# Altium project ADC_schematic.PrjPcb
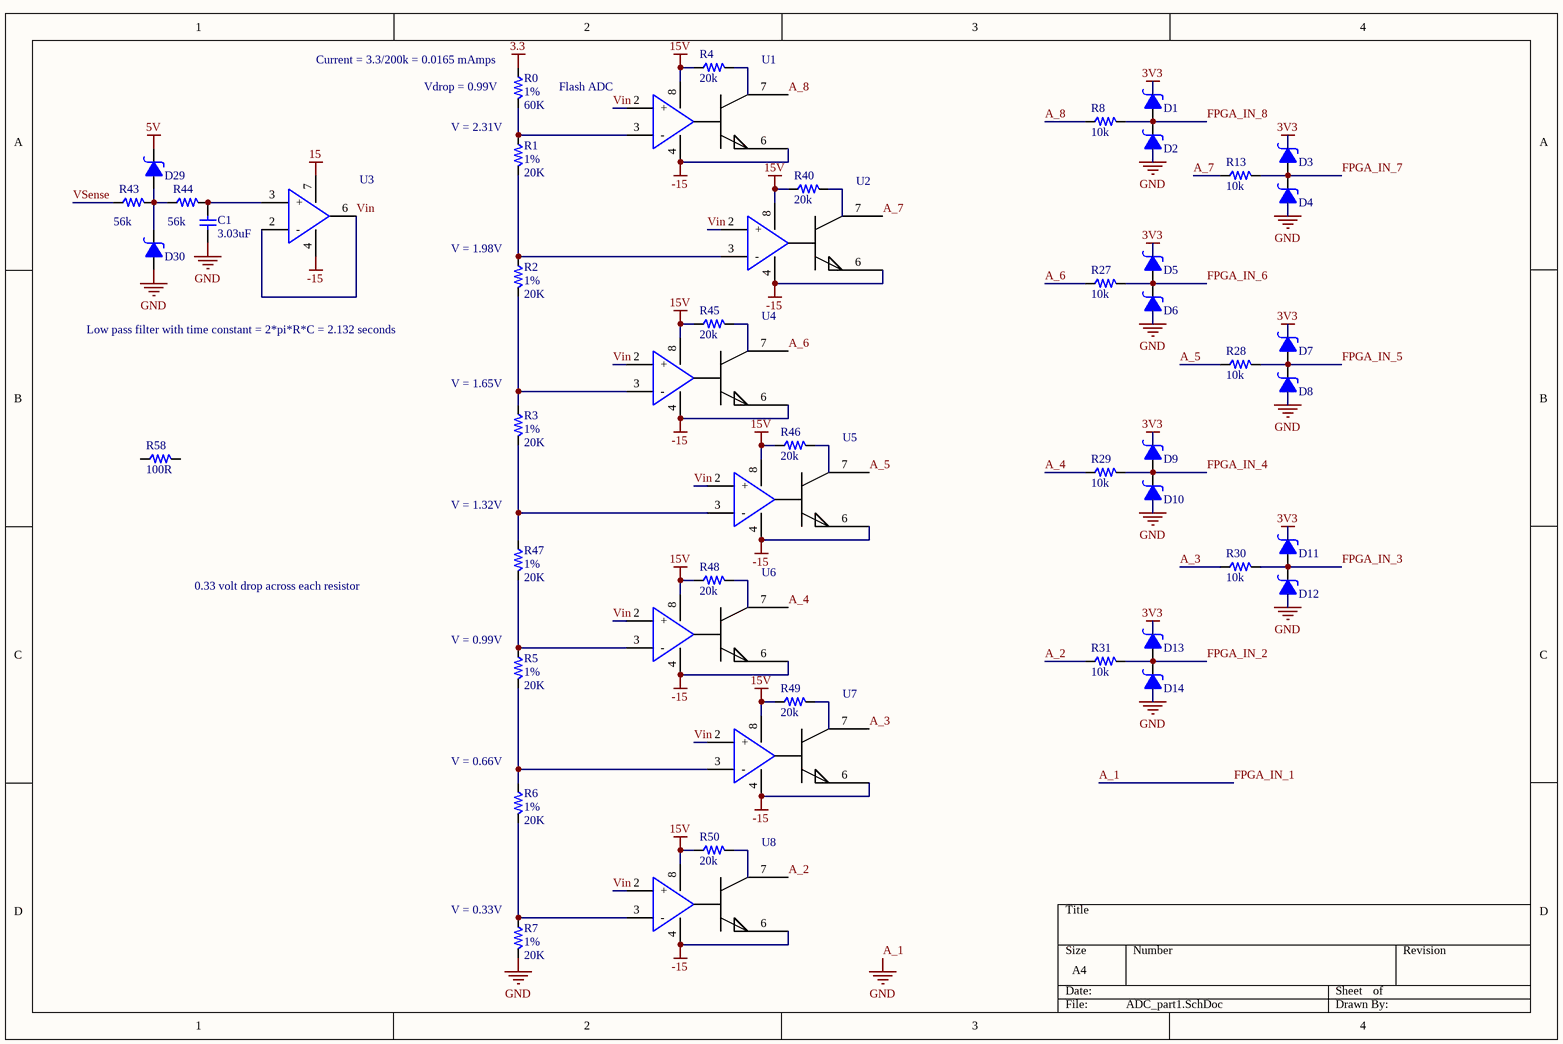
[diagram p0: ADC_part1.SchDoc]
3 sheets, 110 parts. Net scope: global (net labels, ports and power ports of the same name join across sheets).
Sheets:
  ADC_part1.SchDoc
  ADC_part2.SchDoc
  ADC_part3.SchDoc

## Sheet ADC_part1.SchDoc
size A4

### Parts
C1  value 3.03uF  [PCB_GENERIC_SMD_0603]  (hidden comment: C060-0001U-00)
D1  ONSEMI_MBRM110LT1G  [ON Semi Schottky Diode - MBRM110LT1G]  (value not drawn)
D2  ONSEMI_MBRM110LT1G  [ON Semi Schottky Diode - MBRM110LT1G]  (value not drawn)
D3  ONSEMI_MBRM110LT1G  [ON Semi Schottky Diode - MBRM110LT1G]  (value not drawn)
D4  ONSEMI_MBRM110LT1G  [ON Semi Schottky Diode - MBRM110LT1G]  (value not drawn)
D5  ONSEMI_MBRM110LT1G  [ON Semi Schottky Diode - MBRM110LT1G]  (value not drawn)
D6  ONSEMI_MBRM110LT1G  [ON Semi Schottky Diode - MBRM110LT1G]  (value not drawn)
D7  ONSEMI_MBRM110LT1G  [ON Semi Schottky Diode - MBRM110LT1G]  (value not drawn)
D8  ONSEMI_MBRM110LT1G  [ON Semi Schottky Diode - MBRM110LT1G]  (value not drawn)
D9  ONSEMI_MBRM110LT1G  [ON Semi Schottky Diode - MBRM110LT1G]  (value not drawn)
D10  ONSEMI_MBRM110LT1G  [ON Semi Schottky Diode - MBRM110LT1G]  (value not drawn)
D11  ONSEMI_MBRM110LT1G  [ON Semi Schottky Diode - MBRM110LT1G]  (value not drawn)
D12  ONSEMI_MBRM110LT1G  [ON Semi Schottky Diode - MBRM110LT1G]  (value not drawn)
D13  ONSEMI_MBRM110LT1G  [ON Semi Schottky Diode - MBRM110LT1G]  (value not drawn)
D14  ONSEMI_MBRM110LT1G  [ON Semi Schottky Diode - MBRM110LT1G]  (value not drawn)
D29  ONSEMI_MBRM110LT1G  [ON Semi Schottky Diode - MBRM110LT1G]  (value not drawn)
D30  ONSEMI_MBRM110LT1G  [ON Semi Schottky Diode - MBRM110LT1G]  (value not drawn)
R0  value 60K  Tolerance: 1%  [PCB_GENERIC_SMD_0603]  (hidden comment: R060-00103-01)
R1  value 20K  Tolerance: 1%  [PCB_GENERIC_SMD_0603]  (hidden comment: R060-00103-01)
R2  value 20K  Tolerance: 1%  [PCB_GENERIC_SMD_0603]  (hidden comment: R060-00103-01)
R3  value 20K  Tolerance: 1%  [PCB_GENERIC_SMD_0603]  (hidden comment: R060-00103-01)
R4  value 20k  [PCB_GENERIC_SMD_0603]  (hidden comment: R060-00101-05)
R5  value 20K  Tolerance: 1%  [PCB_GENERIC_SMD_0603]  (hidden comment: R060-00103-01)
R6  value 20K  Tolerance: 1%  [PCB_GENERIC_SMD_0603]  (hidden comment: R060-00103-01)
R7  value 20K  Tolerance: 1%  [PCB_GENERIC_SMD_0603]  (hidden comment: R060-00103-01)
R8  value 10k  [PCB_GENERIC_SMD_0603]  (hidden comment: R060-00101-05)
R13  value 10k  [PCB_GENERIC_SMD_0603]  (hidden comment: R060-00101-05)
R27  value 10k  [PCB_GENERIC_SMD_0603]  (hidden comment: R060-00101-05)
R28  value 10k  [PCB_GENERIC_SMD_0603]  (hidden comment: R060-00101-05)
R29  value 10k  [PCB_GENERIC_SMD_0603]  (hidden comment: R060-00101-05)
R30  value 10k  [PCB_GENERIC_SMD_0603]  (hidden comment: R060-00101-05)
R31  value 10k  [PCB_GENERIC_SMD_0603]  (hidden comment: R060-00101-05)
R40  value 20k  [PCB_GENERIC_SMD_0603]  (hidden comment: R060-00101-05)
R43  value 56k  [PCB_GENERIC_SMD_0603]  (hidden comment: R060-00101-05)
R44  value 56k  [PCB_GENERIC_SMD_0603]  (hidden comment: R060-00101-05)
R45  value 20k  [PCB_GENERIC_SMD_0603]  (hidden comment: R060-00101-05)
R46  value 20k  [PCB_GENERIC_SMD_0603]  (hidden comment: R060-00101-05)
R47  value 20K  Tolerance: 1%  [PCB_GENERIC_SMD_0603]  (hidden comment: R060-00103-01)
R48  value 20k  [PCB_GENERIC_SMD_0603]  (hidden comment: R060-00101-05)
R49  value 20k  [PCB_GENERIC_SMD_0603]  (hidden comment: R060-00101-05)
R50  value 20k  [PCB_GENERIC_SMD_0603]  (hidden comment: R060-00101-05)
R58  value 100R  [PCB_GENERIC_SMD_0603]  (hidden comment: R060-00101-05)
U1  AP331A  [SOT95P285X130-5N]  (value not drawn)
U2  AP331A  [SOT95P285X130-5N]  (value not drawn)
U3  AP331A  [SOT95P285X130-5N]  (value not drawn)
U4  AP331A  [SOT95P285X130-5N]  (value not drawn)
U5  AP331A  [SOT95P285X130-5N]  (value not drawn)
U6  AP331A  [SOT95P285X130-5N]  (value not drawn)
U7  AP331A  [SOT95P285X130-5N]  (value not drawn)
U8  AP331A  [SOT95P285X130-5N]  (value not drawn)

### Nets
3.3: R0.1
3V3: D1.1 D3.1 D5.1 D7.1 D9.1 D11.1 D13.1
5V: D29.1
15: U3.7(VCC)
15V: R4.1 R40.1 R45.1 R46.1 R48.1 R49.1 R50.1 U1.8(VCC) U2.8(VCC) U4.8(VCC) U5.8(VCC) U6.8(VCC) U7.8(VCC) U8.8(VCC)
-15: U1.4(GND) U1.6 U2.4(GND) U2.6 U3.4(GND) U4.4(GND) U4.6 U5.4(GND) U5.6 U6.4(GND) U6.6 U7.4(GND) U7.6 U8.4(GND) U8.6
A_1: C1.1 D2.2 D4.2 D6.2 D8.2 D10.2 D12.2 D14.2 D30.2 R7.2  [also labelled FPGA_IN_1, GND]
A_2: R31.1 U8.7
A_3: R30.1 U7.7
A_4: R29.1 U6.7
A_5: R28.1 U5.7
A_6: R27.1 U4.7
A_7: R13.1 U2.7
A_8: R8.1 U1.7
FPGA_IN_2: D13.2 D14.1 R31.2
FPGA_IN_3: D11.2 D12.1 R30.2
FPGA_IN_4: D9.2 D10.1 R29.2
FPGA_IN_5: D7.2 D8.1 R28.2
FPGA_IN_6: D5.2 D6.1 R27.2
FPGA_IN_7: D3.2 D4.1 R13.2
FPGA_IN_8: D1.2 D2.1 R8.2
Vin: U1.2(+) U2.2(+) U3.2(-) U3.6 U4.2(+) U5.2(+) U6.2(+) U7.2(+) U8.2(+)
VSense: R43.1
NetC1_2: C1.2 R44.2 U3.3(+)
NetD29_2: D29.2 D30.1 R43.2 R44.1
NetR0_2: R0.2 R1.1 U1.3(-)
NetR1_2: R1.2 R2.1 U2.3(-)
NetR2_2: R2.2 R3.1 U4.3(-)
NetR3_2: R3.2 R47.1 U5.3(-)
NetR5_1: R5.1 R47.2 U6.3(-)
NetR5_2: R5.2 R6.1 U7.3(-)
NetR6_2: R6.2 R7.1 U8.3(-)

Not connected (* = marked no-connect by the designer): R4 2; R40 2; R45 2; R46 2; R48 2; R49 2; R50 2; R58 1 2

### Notes on the sheet
- (near R0) Current = 3.3/200k = 0.0165 mAmps
- (near R0) Vdrop = 0.99V
- Flash ADC
- V = 2.31V
- (near R2) V = 1.98V
- Low pass filter with time constant = 2*pi*R*C = 2.132 seconds
- (near R3) V = 1.65V
- (near R47) V = 1.32V
- 0.33 volt drop across each resistor
- (near R5) V = 0.99V
- (near R6) V = 0.66V
- (near R7) V = 0.33V

### Library data of the parts
C1 = C060-0001U-00: CAP CER 0603 1uF 16V X5R 20%; Tolerance: 20%; Voltage: 16V; Package: 0603
D1-D14 D29 D30 = ONSEMI_MBRM110LT1G: DIODE SCHOTTKY 10V 1A; Supplier 1: Digi-Key; Supplier Part Number 1: MBRM110LT1GOSDKR-ND
R0-R3 R5-R7 R47 = R060-00103-01: RES 0603 10K 1% 100mW; Power: 100mW; Package: 0603
R4 R8 R13 R27-R31 R40 R43-R46 R48-R50 R58 = R060-00101-05: RES 0603 100ohm 5% 63mW; Tolerance: 5%; Power: 63mW; Package: 0603
U1-U8 = AP331A: Single Channel Comparator, Open Drain, SC-74A/SOT-753; Supplier 1: Digikey; Supplier Part Number 1: AP331AWGDICT-ND

## Sheet ADC_part2.SchDoc
size A4
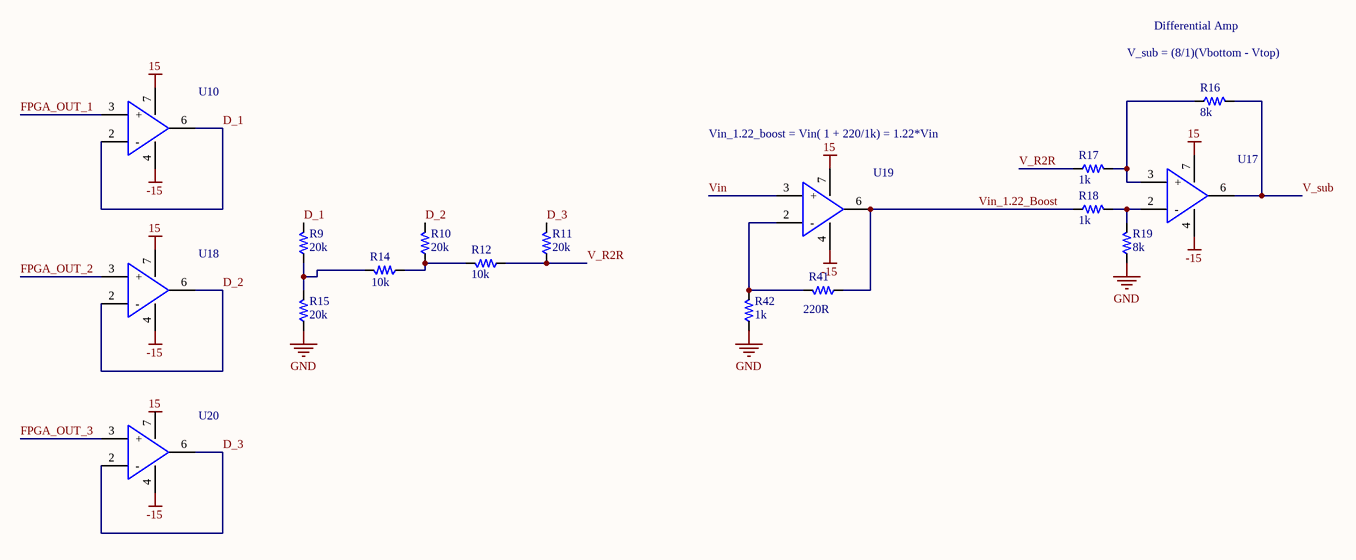
[diagram p1: ADC_part2.SchDoc]

### Parts
R9  value 20k  [PCB_GENERIC_SMD_0603]  (hidden comment: R060-00101-05)
R10  value 20k  [PCB_GENERIC_SMD_0603]  (hidden comment: R060-00101-05)
R11  value 20k  [PCB_GENERIC_SMD_0603]  (hidden comment: R060-00101-05)
R12  value 10k  [PCB_GENERIC_SMD_0603]  (hidden comment: R060-00101-05)
R14  value 10k  [PCB_GENERIC_SMD_0603]  (hidden comment: R060-00101-05)
R15  value 20k  [PCB_GENERIC_SMD_0603]  (hidden comment: R060-00101-05)
R16  value 8k  [PCB_GENERIC_SMD_0603]  (hidden comment: R060-00101-05)
R17  value 1k  [PCB_GENERIC_SMD_0603]  (hidden comment: R060-00101-05)
R18  value 1k  [PCB_GENERIC_SMD_0603]  (hidden comment: R060-00101-05)
R19  value 8k  [PCB_GENERIC_SMD_0603]  (hidden comment: R060-00101-05)
R41  value 220R  [PCB_GENERIC_SMD_0603]  (hidden comment: R060-00101-05)
R42  value 1k  [PCB_GENERIC_SMD_0603]  (hidden comment: R060-00101-05)
U10  AP331A  [SOT95P285X130-5N]  (value not drawn)
U17  AP331A  [SOT95P285X130-5N]  (value not drawn)
U18  AP331A  [SOT95P285X130-5N]  (value not drawn)
U19  AP331A  [SOT95P285X130-5N]  (value not drawn)
U20  AP331A  [SOT95P285X130-5N]  (value not drawn)

### Nets
15: U10.7(VCC) U17.7(VCC) U18.7(VCC) U19.7(VCC)
-15: U10.4(GND) U17.4(GND) U18.4(GND) U19.4(GND) U20.4(GND)
GND: R15.1 R19.1 R42.1  [project net A_1]
D_1: R9.2 U10.2(-) U10.6
D_2: R10.2 U18.2(-) U18.6
D_3: R11.2 U20.2(-) U20.6
FPGA_OUT_1: U10.3(+)
FPGA_OUT_2: U18.3(+)
FPGA_OUT_3: U20.3(+)
V_R2R: R11.1 R12.1 R17.1
V_sub: R16.2 U17.6
Vin: U19.3(+)
Vin_1.22_Boost: R18.1 R41.1 U19.6
NetR9_1: R9.1 R14.2 R15.2
NetR10_1: R10.1 R12.2 R14.1
NetR16_1: R16.1 R17.2 U17.3(+)
NetR18_2: R18.2 R19.2 U17.2(-)
NetR41_2: R41.2 R42.2 U19.2(-)

Not connected (* = marked no-connect by the designer): U20 7(VCC)

### Notes on the sheet
- (near R16) V_sub = (8/1)(Vbottom - Vtop)
- Differential Amp
- Vin_1.22_boost = Vin( 1 + 220/1k) = 1.22*Vin
- Labels drawn without touching a wire or pin: 15

### Library data of the parts
R9-R12 R14-R19 R41 R42 = R060-00101-05: RES 0603 100ohm 5% 63mW; Tolerance: 5%; Power: 63mW; Package: 0603
U10 U17-U20 = AP331A: as U1 on sheet ADC_part1; Supplier 1: Digikey; Supplier Part Number 1: AP331AWGDICT-ND

## Sheet ADC_part3.SchDoc
size A4
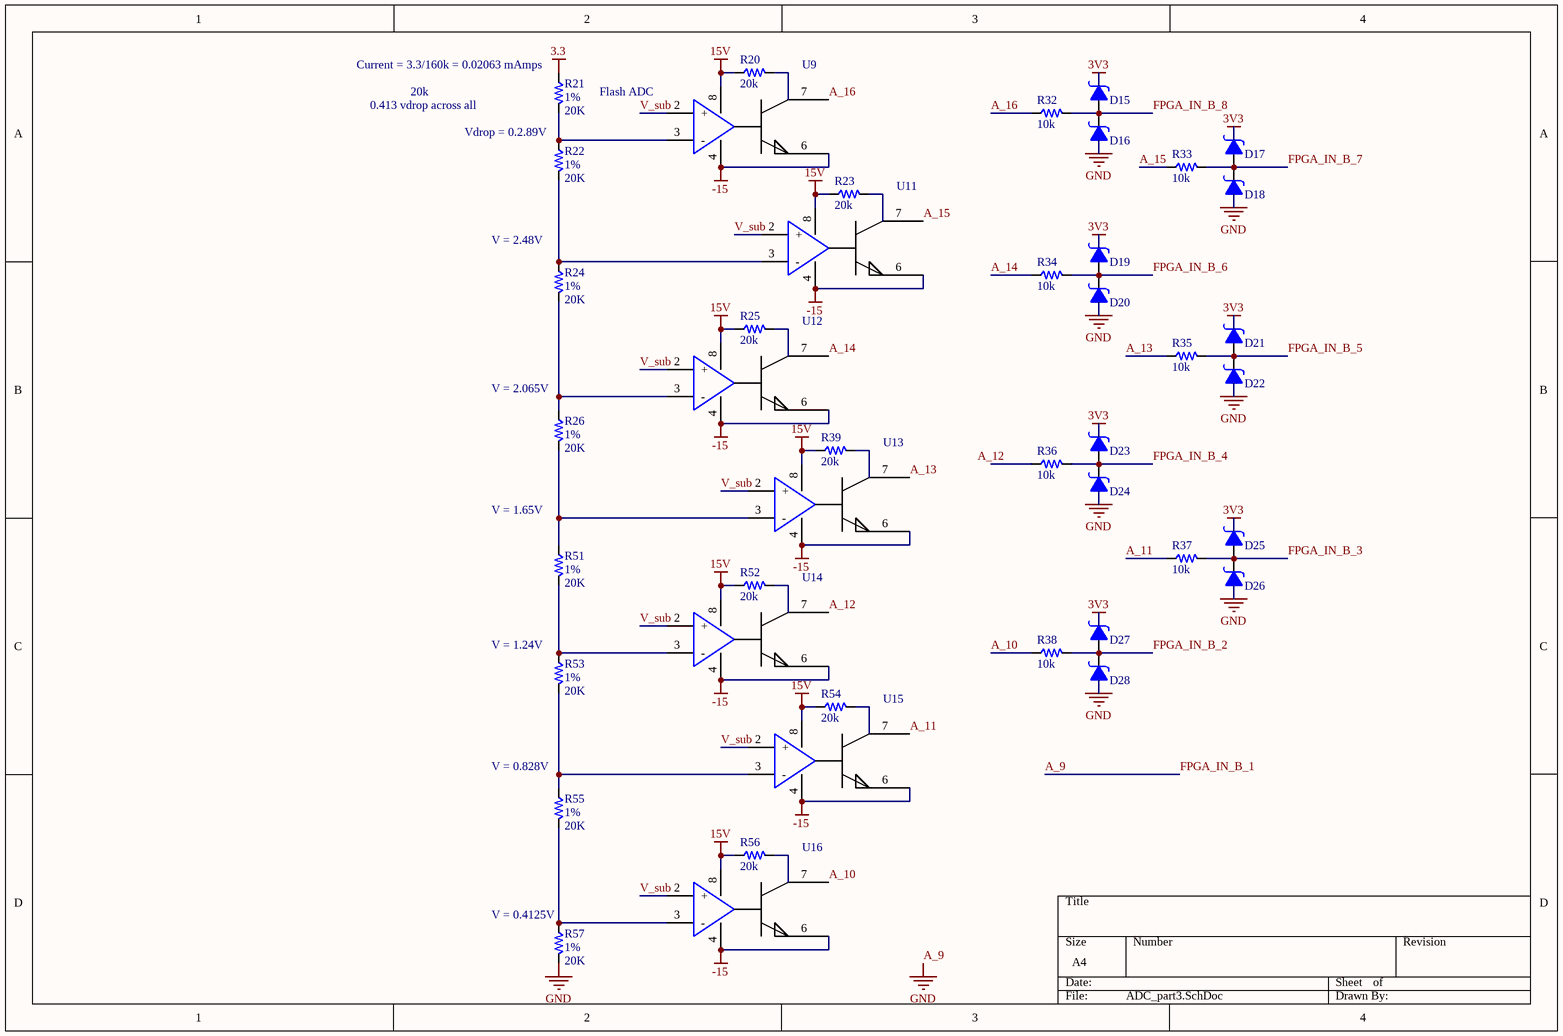
[diagram p2: ADC_part3.SchDoc]

### Parts
D15  ONSEMI_MBRM110LT1G  [ON Semi Schottky Diode - MBRM110LT1G]  (value not drawn)
D16  ONSEMI_MBRM110LT1G  [ON Semi Schottky Diode - MBRM110LT1G]  (value not drawn)
D17  ONSEMI_MBRM110LT1G  [ON Semi Schottky Diode - MBRM110LT1G]  (value not drawn)
D18  ONSEMI_MBRM110LT1G  [ON Semi Schottky Diode - MBRM110LT1G]  (value not drawn)
D19  ONSEMI_MBRM110LT1G  [ON Semi Schottky Diode - MBRM110LT1G]  (value not drawn)
D20  ONSEMI_MBRM110LT1G  [ON Semi Schottky Diode - MBRM110LT1G]  (value not drawn)
D21  ONSEMI_MBRM110LT1G  [ON Semi Schottky Diode - MBRM110LT1G]  (value not drawn)
D22  ONSEMI_MBRM110LT1G  [ON Semi Schottky Diode - MBRM110LT1G]  (value not drawn)
D23  ONSEMI_MBRM110LT1G  [ON Semi Schottky Diode - MBRM110LT1G]  (value not drawn)
D24  ONSEMI_MBRM110LT1G  [ON Semi Schottky Diode - MBRM110LT1G]  (value not drawn)
D25  ONSEMI_MBRM110LT1G  [ON Semi Schottky Diode - MBRM110LT1G]  (value not drawn)
D26  ONSEMI_MBRM110LT1G  [ON Semi Schottky Diode - MBRM110LT1G]  (value not drawn)
D27  ONSEMI_MBRM110LT1G  [ON Semi Schottky Diode - MBRM110LT1G]  (value not drawn)
D28  ONSEMI_MBRM110LT1G  [ON Semi Schottky Diode - MBRM110LT1G]  (value not drawn)
R20  value 20k  [PCB_GENERIC_SMD_0603]  (hidden comment: R060-00101-05)
R21  value 20K  Tolerance: 1%  [PCB_GENERIC_SMD_0603]  (hidden comment: R060-00103-01)
R22  value 20K  Tolerance: 1%  [PCB_GENERIC_SMD_0603]  (hidden comment: R060-00103-01)
R23  value 20k  [PCB_GENERIC_SMD_0603]  (hidden comment: R060-00101-05)
R24  value 20K  Tolerance: 1%  [PCB_GENERIC_SMD_0603]  (hidden comment: R060-00103-01)
R25  value 20k  [PCB_GENERIC_SMD_0603]  (hidden comment: R060-00101-05)
R26  value 20K  Tolerance: 1%  [PCB_GENERIC_SMD_0603]  (hidden comment: R060-00103-01)
R32  value 10k  [PCB_GENERIC_SMD_0603]  (hidden comment: R060-00101-05)
R33  value 10k  [PCB_GENERIC_SMD_0603]  (hidden comment: R060-00101-05)
R34  value 10k  [PCB_GENERIC_SMD_0603]  (hidden comment: R060-00101-05)
R35  value 10k  [PCB_GENERIC_SMD_0603]  (hidden comment: R060-00101-05)
R36  value 10k  [PCB_GENERIC_SMD_0603]  (hidden comment: R060-00101-05)
R37  value 10k  [PCB_GENERIC_SMD_0603]  (hidden comment: R060-00101-05)
R38  value 10k  [PCB_GENERIC_SMD_0603]  (hidden comment: R060-00101-05)
R39  value 20k  [PCB_GENERIC_SMD_0603]  (hidden comment: R060-00101-05)
R51  value 20K  Tolerance: 1%  [PCB_GENERIC_SMD_0603]  (hidden comment: R060-00103-01)
R52  value 20k  [PCB_GENERIC_SMD_0603]  (hidden comment: R060-00101-05)
R53  value 20K  Tolerance: 1%  [PCB_GENERIC_SMD_0603]  (hidden comment: R060-00103-01)
R54  value 20k  [PCB_GENERIC_SMD_0603]  (hidden comment: R060-00101-05)
R55  value 20K  Tolerance: 1%  [PCB_GENERIC_SMD_0603]  (hidden comment: R060-00103-01)
R56  value 20k  [PCB_GENERIC_SMD_0603]  (hidden comment: R060-00101-05)
R57  value 20K  Tolerance: 1%  [PCB_GENERIC_SMD_0603]  (hidden comment: R060-00103-01)
U9  AP331A  [SOT95P285X130-5N]  (value not drawn)
U11  AP331A  [SOT95P285X130-5N]  (value not drawn)
U12  AP331A  [SOT95P285X130-5N]  (value not drawn)
U13  AP331A  [SOT95P285X130-5N]  (value not drawn)
U14  AP331A  [SOT95P285X130-5N]  (value not drawn)
U15  AP331A  [SOT95P285X130-5N]  (value not drawn)
U16  AP331A  [SOT95P285X130-5N]  (value not drawn)

### Nets
3.3: R21.1
3V3: D15.1 D17.1 D19.1 D21.1 D23.1 D25.1 D27.1
15V: R20.1 R23.1 R25.1 R39.1 R52.1 R54.1 R56.1 U9.8(VCC) U11.8(VCC) U12.8(VCC) U13.8(VCC) U14.8(VCC) U15.8(VCC) U16.8(VCC)
-15: U9.4(GND) U9.6 U11.4(GND) U11.6 U12.4(GND) U12.6 U13.4(GND) U13.6 U14.4(GND) U14.6 U15.4(GND) U15.6 U16.4(GND) U16.6
A_9: D16.2 D18.2 D20.2 D22.2 D24.2 D26.2 D28.2 R57.2  [also labelled FPGA_IN_B_1, GND]  [project net A_1]
A_10: R38.1 U16.7
A_11: R37.1 U15.7
A_12: U14.7
A_13: R35.1 U13.7
A_14: R34.1 U12.7
A_15: R33.1 U11.7
A_16: R32.1 U9.7
FPGA_IN_B_2: D27.2 D28.1 R38.2
FPGA_IN_B_3: D25.2 D26.1 R37.2
FPGA_IN_B_4: D23.2 D24.1 R36.2
FPGA_IN_B_5: D21.2 D22.1 R35.2
FPGA_IN_B_6: D19.2 D20.1 R34.2
FPGA_IN_B_7: D17.2 D18.1 R33.2
FPGA_IN_B_8: D15.2 D16.1 R32.2
V_sub: U9.2(+) U11.2(+) U12.2(+) U13.2(+) U14.2(+) U15.2(+) U16.2(+)
NetR21_2: R21.2 R22.1 U9.3(-)
NetR22_2: R22.2 R24.1 U11.3(-)
NetR24_2: R24.2 R26.1 U12.3(-)
NetR26_2: R26.2 R51.1 U13.3(-)
NetR51_2: R51.2 R53.1 U14.3(-)
NetR53_2: R53.2 R55.1 U15.3(-)
NetR55_2: R55.2 R57.1 U16.3(-)

Not connected (* = marked no-connect by the designer): R20 2; R23 2; R25 2; R36 1; R39 2; R52 2; R54 2; R56 2

### Notes on the sheet
- (near R21) Current = 3.3/160k = 0.02063 mAmps
- 0.413 vdrop across all
- 20k
- Flash ADC
- (near R22) Vdrop = 0.2.89V
- (near R24) V = 2.48V
- (near R26) V = 2.065V
- (near R51) V = 1.65V
- (near R53) V = 1.24V
- (near R55) V = 0.828V
- (near R57) V = 0.4125V
- Labels drawn without touching a wire or pin: A_12

### Library data of the parts
D15-D28 = ONSEMI_MBRM110LT1G: DIODE SCHOTTKY 10V 1A; Supplier 1: Digi-Key; Supplier Part Number 1: MBRM110LT1GOSDKR-ND
R20 R23 R25 R32-R39 R52 R54 R56 = R060-00101-05: RES 0603 100ohm 5% 63mW; Tolerance: 5%; Power: 63mW; Package: 0603
R21 R22 R24 R26 R51 R53 R55 R57 = R060-00103-01: RES 0603 10K 1% 100mW; Power: 100mW; Package: 0603
U9 U11-U16 = AP331A: as U1 on sheet ADC_part1; Supplier 1: Digikey; Supplier Part Number 1: AP331AWGDICT-ND

## Nets that join several sheets
3.3: ADC_part1 (R0.1), ADC_part3 (R21.1)
3V3: ADC_part1 (7 pins), ADC_part3 (7 pins)
15: ADC_part1 (U3.7), ADC_part2 (U10.7 U17.7 U18.7 U19.7)
15V: ADC_part1 (14 pins), ADC_part3 (14 pins)
-15: ADC_part1 (15 pins), ADC_part2 (5 pins), ADC_part3 (14 pins)
A_1: ADC_part1 (10 pins), ADC_part2 (R15.1 R19.1 R42.1), ADC_part3 (8 pins)
V_sub: ADC_part2 (R16.2 U17.6), ADC_part3 (7 pins)
Vin: ADC_part1 (9 pins), ADC_part2 (U19.3)